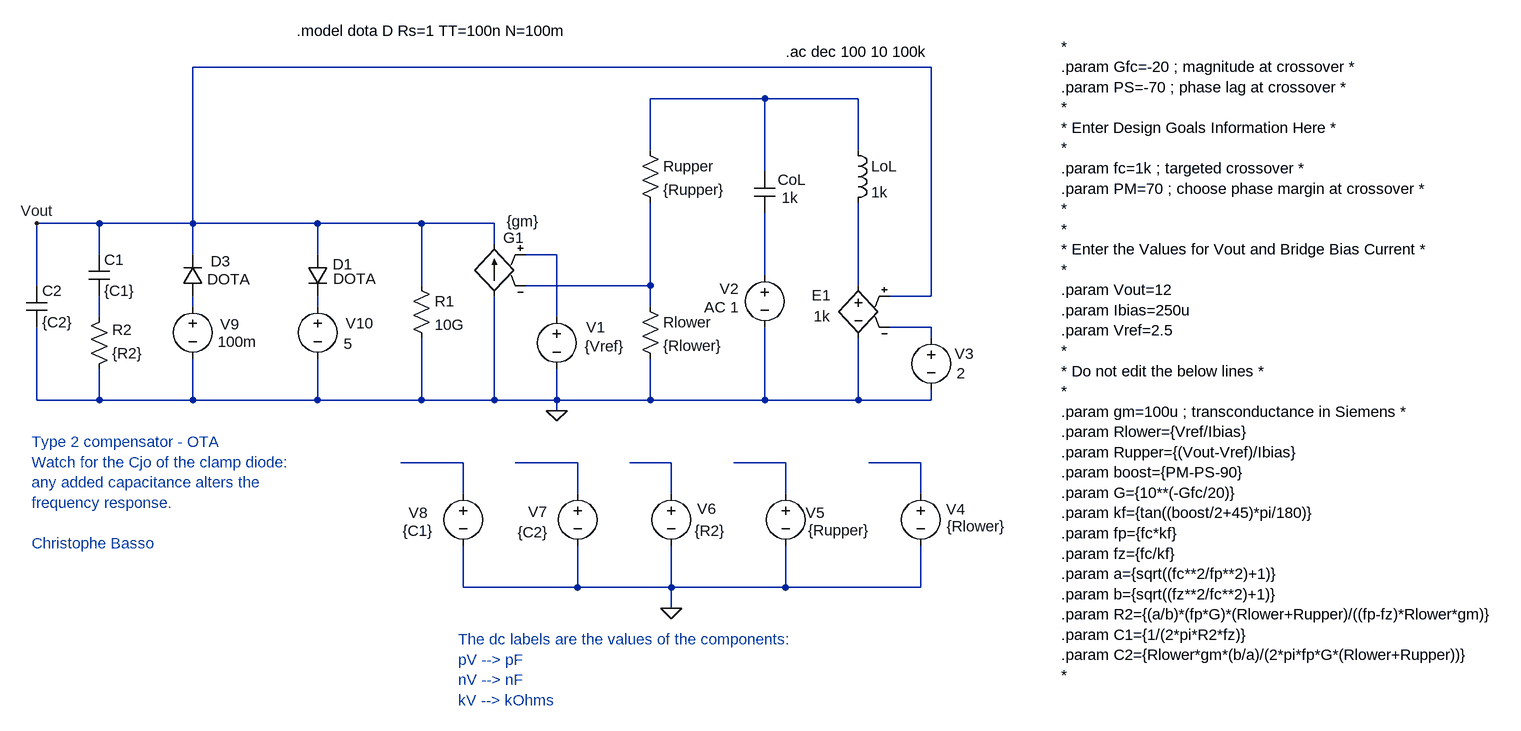
[diagram p0: schematic type 2 - OTA.asc]
type 2 - OTA.asc, the LTspice schematic file:
Version 4
SHEET 1 1836 1096
WIRE 816 -128 -320 -128
WIRE 560 -80 384 -80
WIRE 704 -80 560 -80
WIRE 384 0 384 -80
WIRE 704 0 704 -80
WIRE 560 32 560 -80
WIRE -464 112 -560 112
WIRE -320 112 -320 -128
WIRE -320 112 -464 112
WIRE -128 112 -320 112
WIRE 32 112 -128 112
WIRE 144 112 32 112
WIRE 144 144 144 112
WIRE -464 160 -464 112
WIRE -320 160 -320 112
WIRE -128 160 -128 112
WIRE 240 160 192 160
WIRE 560 192 560 96
WIRE -560 208 -560 112
WIRE 32 208 32 112
WIRE 384 208 384 80
WIRE 384 208 192 208
WIRE 704 208 704 80
WIRE 816 224 816 -128
WIRE 816 224 752 224
WIRE -320 240 -320 224
WIRE -128 240 -128 224
WIRE 384 240 384 208
WIRE -464 256 -464 224
WIRE 240 256 240 160
WIRE 816 272 752 272
WIRE 816 288 816 272
WIRE -560 384 -560 272
WIRE -464 384 -464 336
WIRE -464 384 -560 384
WIRE -320 384 -320 320
WIRE -320 384 -464 384
WIRE -128 384 -128 320
WIRE -128 384 -320 384
WIRE 32 384 32 288
WIRE 32 384 -128 384
WIRE 144 384 144 224
WIRE 144 384 32 384
WIRE 240 384 240 336
WIRE 240 384 144 384
WIRE 384 384 384 320
WIRE 384 384 240 384
WIRE 560 384 560 272
WIRE 560 384 384 384
WIRE 704 384 704 288
WIRE 704 384 560 384
WIRE 816 384 816 368
WIRE 816 384 704 384
WIRE 240 400 240 384
WIRE 96 480 0 480
WIRE 272 480 176 480
WIRE 416 480 352 480
WIRE 592 480 512 480
WIRE 800 480 720 480
WIRE 96 528 96 480
WIRE 272 528 272 480
WIRE 416 528 416 480
WIRE 592 528 592 480
WIRE 800 528 800 480
WIRE 96 672 96 608
WIRE 272 672 272 608
WIRE 272 672 96 672
WIRE 416 672 416 608
WIRE 416 672 272 672
WIRE 592 672 592 608
WIRE 592 672 416 672
WIRE 800 672 800 608
WIRE 800 672 592 672
WIRE 416 704 416 672
FLAG 240 400 0
FLAG -560 112 Vout
FLAG 416 704 0
DATAFLAG 624 -80 ""
DATAFLAG 112 -128 ""
DATAFLAG 352 208 ""
DATAFLAG 16 480 ""
DATAFLAG 208 480 ""
DATAFLAG 384 480 ""
DATAFLAG 528 480 ""
DATAFLAG 752 480 ""
SYMBOL res 368 224 R0
SYMATTR InstName Rlower
SYMATTR Value {Rlower}
SYMBOL res 368 -16 R0
SYMATTR InstName Rupper
SYMATTR Value {Rupper}
SYMBOL voltage 240 240 R0
WINDOW 0 45 32 Left 2
WINDOW 3 43 61 Left 2
WINDOW 123 0 0 Left 0
WINDOW 39 0 0 Left 0
SYMATTR InstName V1
SYMATTR Value {Vref}
SYMBOL cap -480 224 M180
WINDOW 0 24 56 Left 2
WINDOW 3 24 8 Left 2
SYMATTR InstName C1
SYMATTR Value {C1}
SYMBOL cap 544 32 R0
WINDOW 0 36 13 Left 2
WINDOW 3 42 41 Left 2
SYMATTR InstName CoL
SYMATTR Value 1k
SYMBOL voltage 560 176 M0
WINDOW 0 40 37 Left 2
WINDOW 123 40 65 Left 2
WINDOW 39 0 0 Left 0
SYMATTR InstName V2
SYMATTR Value2 AC 1
SYMATTR Value ""
SYMBOL ind 688 -16 R0
SYMATTR InstName LoL
SYMATTR Value 1k
SYMBOL e 704 192 M0
WINDOW 0 43 31 Left 2
WINDOW 3 43 63 Left 2
SYMATTR InstName E1
SYMATTR Value 1k
SYMBOL voltage 816 272 R0
WINDOW 0 36 41 Left 2
WINDOW 3 39 71 Left 2
SYMATTR InstName V3
SYMATTR Value 2
SYMBOL res -480 352 M180
WINDOW 0 36 76 Left 2
WINDOW 3 36 40 Left 2
SYMATTR InstName R2
SYMATTR Value {R2}
SYMBOL cap -576 272 M180
WINDOW 0 24 56 Left 2
WINDOW 3 24 8 Left 2
SYMATTR InstName C2
SYMATTR Value {C2}
SYMBOL voltage 800 512 R0
WINDOW 0 39 40 Left 2
WINDOW 3 40 66 Left 2
WINDOW 123 0 0 Left 0
WINDOW 39 0 0 Left 0
SYMATTR InstName V4
SYMATTR Value {Rlower}
SYMBOL voltage 592 512 R0
WINDOW 0 31 45 Left 2
WINDOW 3 35 72 Left 2
WINDOW 123 0 0 Left 0
WINDOW 39 0 0 Left 0
SYMATTR InstName V5
SYMATTR Value {Rupper}
SYMBOL voltage 416 512 R0
WINDOW 0 40 39 Left 2
WINDOW 3 36 73 Left 2
WINDOW 123 0 0 Left 0
WINDOW 39 0 0 Left 0
SYMATTR InstName V6
SYMATTR Value {R2}
SYMBOL voltage 272 512 R0
WINDOW 0 -76 44 Left 2
WINDOW 3 -92 75 Left 2
SYMATTR InstName V7
SYMATTR Value {C2}
SYMBOL voltage 96 512 R0
WINDOW 0 -84 45 Left 2
WINDOW 3 -93 73 Left 2
WINDOW 123 0 0 Left 0
WINDOW 39 0 0 Left 0
SYMATTR InstName V8
SYMATTR Value {C1}
SYMBOL g 144 128 M0
WINDOW 0 -46 6 Left 2
WINDOW 3 -69 -19 Left 2
SYMATTR InstName G1
SYMATTR Value {gm}
SYMBOL res 16 192 R0
SYMATTR InstName R1
SYMATTR Value 10G
SYMBOL voltage -320 224 R0
WINDOW 0 42 43 Left 2
WINDOW 3 38 70 Left 2
WINDOW 123 0 0 Left 0
WINDOW 39 0 0 Left 0
SYMATTR InstName V9
SYMATTR Value 100m
SYMBOL voltage -128 224 R0
WINDOW 0 43 42 Left 2
WINDOW 3 40 73 Left 2
SYMATTR InstName V10
SYMATTR Value 5
SYMBOL diode -304 224 R180
WINDOW 0 -42 54 Left 2
WINDOW 3 -73 26 Left 2
SYMATTR InstName D3
SYMATTR Value DOTA
SYMBOL diode -144 160 R0
WINDOW 0 39 15 Left 2
WINDOW 3 40 37 Left 2
SYMATTR InstName D1
SYMATTR Value DOTA
TEXT 1016 -160 Left 2 !*\n.param Gfc=-20 ; magnitude at crossover *\n.param PS=-70 ; phase lag at crossover *\n*\n* Enter Design Goals Information Here *\n*\n.param fc=1k ; targeted crossover *\n.param PM=70 ; choose phase margin at crossover *\n*\n*\n* Enter the Values for Vout and Bridge Bias Current *\n*\n.param Vout=12\n.param Ibias=250u\n.param Vref=2.5\n*\n* Do not edit the below lines *\n*\n.param gm=100u ; transconductance in Siemens *\n.param Rlower={Vref/Ibias}\n.param Rupper={(Vout-Vref)/Ibias}\n.param boost={PM-PS-90}\n.param G={10**(-Gfc/20)}\n.param kf={tan((boost/2+45)*pi/180)}\n.param fp={fc*kf}\n.param fz={fc/kf}\n.param a={sqrt((fc**2/fp**2)+1)}\n.param b={sqrt((fz**2/fc**2)+1)}\n.param R2={(a/b)*(fp*G)*(Rlower+Rupper)/((fp-fz)*Rlower*gm)}\n.param C1={1/(2*pi*R2*fz)}\n.param C2={Rlower*gm*(b/a)/(2*pi*fp*G*(Rlower+Rupper))}\n*
TEXT 592 -152 Left 2 !.ac dec 100 10 100k
TEXT 88 752 Left 2 ;The dc labels are the values of the components:\npV --> pF\nnV --> nF\nkV --> kOhms
TEXT -160 -184 Left 2 !.model dota D Rs=1 TT=100n N=100m
TEXT -568 448 Left 2 ;Type 2 compensator - OTA\nWatch for the Cjo of the clamp diode:\nany added capacitance alters the\nfrequency response. \n \nChristophe Basso

The netlist it stands for:
* type 2 - OTA.asc
Rlower N004 0 {Rlower}
Rupper N001 N004 {Rupper}
V1 N002 0 {Vref}
C1 N008 Vout {C1}
CoL N001 N003 1k
V2 N003 0 AC 1
LoL N001 N005 1k
E1 N005 0 Vout N009 1k
V3 N009 0 2
R2 0 N008 {R2}
C2 0 Vout {C2}
V4 N014 0 {Rlower}
V5 N013 0 {Rupper}
V6 N012 0 {R2}
V7 N011 0 {C2}
V8 N010 0 {C1}
G1 0 Vout N002 N004 {gm}
R1 Vout 0 10G
V9 N006 0 100m
V10 N007 0 5
D3 N006 Vout DOTA
D1 Vout N007 DOTA
.model D D
.lib standard.dio
*
.param Gfc=-20 ; magnitude at crossover *
.param PS=-70 ; phase lag at crossover *
*
* Enter Design Goals Information Here *
*
.param fc=1k ; targeted crossover *
.param PM=70 ; choose phase margin at crossover *
*
*
* Enter the Values for Vout and Bridge Bias Current *
*
.param Vout=12
.param Ibias=250u
.param Vref=2.5
*
* Do not edit the below lines *
*
.param gm=100u ; transconductance in Siemens *
.param Rlower={Vref/Ibias}
.param Rupper={(Vout-Vref)/Ibias}
.param boost={PM-PS-90}
.param G={10**(-Gfc/20)}
.param kf={tan((boost/2+45)*pi/180)}
.param fp={fc*kf}
.param fz={fc/kf}
.param a={sqrt((fc**2/fp**2)+1)}
.param b={sqrt((fz**2/fc**2)+1)}
.param R2={(a/b)*(fp*G)*(Rlower+Rupper)/((fp-fz)*Rlower*gm)}
.param C1={1/(2*pi*R2*fz)}
.param C2={Rlower*gm*(b/a)/(2*pi*fp*G*(Rlower+Rupper))}
*
.ac dec 100 10 100k
* The dc labels are the values of the components:
* pV --> pF
* nV --> nF
* kV --> kOhms
.model dota D Rs=1 TT=100n N=100m
* Type 2 compensator - OTA
* Watch for the Cjo of the clamp diode:
* any added capacitance alters the
* frequency response.
* Christophe Basso
.backanno
.end